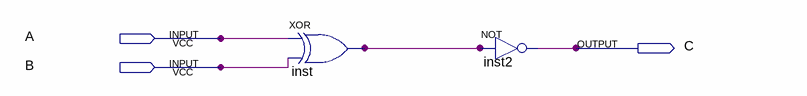
[diagram p0: schematic sheet]
// Quartus schematic first_test.bdf as structural Verilog: 2 symbols, 3 pins
module first_test (
  input  A,
  input  B,
  output C
);

  wire inst_out;

  xor inst (inst_out, A, B);
  not inst2 (C, inst_out);
endmodule
